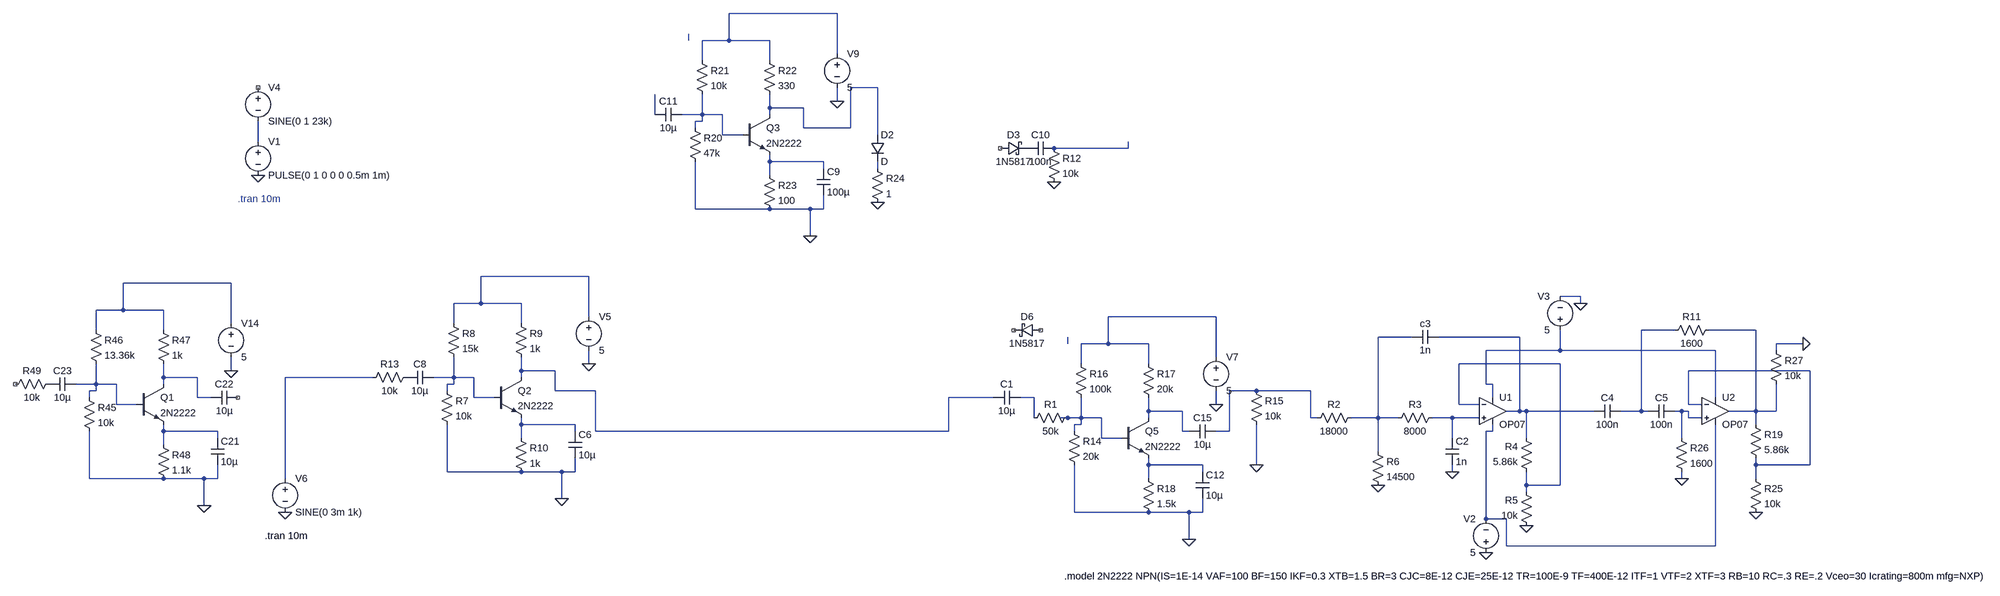
[diagram p0: schematic FinalRx.asc]
FinalRx.asc, the LTspice schematic file:
Version 4
SHEET 1 4116 680
WIRE 768 -880 512 -880
WIRE 416 -816 416 -832
WIRE 512 -816 512 -880
WIRE 512 -816 448 -816
WIRE 608 -816 512 -816
WIRE 768 -784 768 -880
WIRE 448 -768 448 -816
WIRE 608 -768 608 -816
WIRE 864 -704 800 -704
WIRE 768 -672 768 -704
WIRE 608 -656 608 -688
WIRE 688 -656 608 -656
WIRE 336 -640 336 -688
WIRE 448 -640 448 -688
WIRE 448 -640 400 -640
WIRE 496 -640 448 -640
WIRE 608 -640 608 -656
WIRE 448 -624 448 -640
WIRE 448 -624 432 -624
WIRE 432 -608 432 -624
WIRE 688 -608 688 -656
WIRE 800 -608 800 -704
WIRE 800 -608 688 -608
WIRE 496 -592 496 -640
WIRE 544 -592 496 -592
WIRE 864 -592 864 -704
WIRE -720 -576 -720 -624
WIRE 1456 -560 1440 -560
WIRE 1632 -560 1632 -576
WIRE 1632 -560 1456 -560
WIRE 608 -528 608 -544
WIRE 736 -528 608 -528
WIRE 736 -512 736 -528
WIRE 864 -512 864 -528
WIRE 608 -496 608 -528
WIRE 432 -416 432 -528
WIRE 608 -416 432 -416
WIRE 704 -416 608 -416
WIRE 736 -416 736 -448
WIRE 736 -416 704 -416
WIRE 704 -352 704 -416
WIRE 64 -256 -192 -256
WIRE -784 -240 -1040 -240
WIRE 2704 -208 2656 -208
WIRE -192 -192 -192 -256
WIRE -192 -192 -256 -192
WIRE -96 -192 -192 -192
WIRE 2704 -192 2704 -208
WIRE -1040 -176 -1040 -240
WIRE -1040 -176 -1104 -176
WIRE -944 -176 -1040 -176
WIRE 64 -160 64 -256
WIRE 1840 -160 1584 -160
WIRE -784 -144 -784 -240
WIRE -256 -144 -256 -192
WIRE -96 -144 -96 -192
WIRE -1104 -128 -1104 -176
WIRE -944 -128 -944 -176
WIRE 2928 -128 2848 -128
WIRE 3120 -128 3008 -128
WIRE 2304 -112 2224 -112
WIRE 2560 -112 2368 -112
WIRE 1488 -96 1488 -112
WIRE 1584 -96 1584 -160
WIRE 1584 -96 1520 -96
WIRE 1680 -96 1584 -96
WIRE 3232 -96 3168 -96
WIRE 2656 -80 2656 -128
WIRE 2656 -80 2480 -80
WIRE 3024 -80 2656 -80
WIRE 3168 -80 3168 -96
WIRE 1840 -64 1840 -160
WIRE 64 -48 64 -80
WIRE 1520 -48 1520 -96
WIRE 1680 -48 1680 -96
WIRE 2656 -48 2416 -48
WIRE -784 -32 -784 -64
WIRE -96 -32 -96 -64
WIRE -16 -32 -96 -32
WIRE 3248 -32 2960 -32
WIRE -944 -16 -944 -48
WIRE -864 -16 -944 -16
WIRE -448 -16 -656 -16
WIRE -256 -16 -256 -64
WIRE -256 -16 -304 -16
WIRE -208 -16 -256 -16
WIRE -96 -16 -96 -32
WIRE -1104 0 -1104 -48
WIRE -1104 0 -1152 0
WIRE -1056 0 -1104 0
WIRE -944 0 -944 -16
WIRE -256 0 -256 -16
WIRE -256 0 -272 0
WIRE 2480 0 2480 -80
WIRE 2496 0 2480 0
WIRE -1104 16 -1104 0
WIRE -1104 16 -1120 16
WIRE -272 16 -272 0
WIRE -16 16 -16 -32
WIRE 80 16 -16 16
WIRE 1936 16 1872 16
WIRE 2064 16 1936 16
WIRE -1120 32 -1120 16
WIRE -864 32 -864 -16
WIRE -832 32 -864 32
WIRE -208 32 -208 -16
WIRE -160 32 -208 32
WIRE 1312 32 1184 32
WIRE 1408 32 1376 32
WIRE 2496 32 2496 0
WIRE 3024 32 3024 -80
WIRE -1056 48 -1056 0
WIRE -1008 48 -1056 48
WIRE 1840 48 1840 16
WIRE 2416 48 2416 -48
WIRE 2464 48 2416 48
WIRE 2960 48 2960 -32
WIRE 2992 48 2960 48
WIRE 1680 64 1680 32
WIRE 1760 64 1680 64
WIRE 2560 64 2560 -112
WIRE 2560 64 2528 64
WIRE 2576 64 2560 64
WIRE 2736 64 2576 64
WIRE 2848 64 2848 -128
WIRE 2848 64 2800 64
WIRE 2864 64 2848 64
WIRE 2944 64 2928 64
WIRE 2960 64 2944 64
WIRE 3120 64 3120 -128
WIRE 3120 64 3056 64
WIRE 3168 64 3168 0
WIRE 3168 64 3120 64
WIRE 1408 80 1408 32
WIRE 1488 80 1472 80
WIRE 1520 80 1520 32
WIRE 1520 80 1488 80
WIRE 1568 80 1520 80
WIRE 1680 80 1680 64
WIRE 2064 80 2064 16
WIRE 2080 80 2064 80
WIRE 2224 80 2224 -112
WIRE 2224 80 2160 80
WIRE 2272 80 2224 80
WIRE 2400 80 2352 80
WIRE 2464 80 2400 80
WIRE 2960 80 2960 64
WIRE 2992 80 2960 80
WIRE -96 96 -96 80
WIRE 32 96 -96 96
WIRE 1520 96 1520 80
WIRE 1520 96 1504 96
WIRE 3120 96 3120 64
WIRE -944 112 -944 96
WIRE -816 112 -944 112
WIRE 32 112 32 96
WIRE 80 112 80 16
WIRE 1184 112 1184 32
WIRE 1184 112 80 112
WIRE 1504 112 1504 96
WIRE 1760 112 1760 64
WIRE 1776 112 1760 112
WIRE 1872 112 1872 16
WIRE 1872 112 1840 112
WIRE 2496 112 2496 96
WIRE 2496 112 2480 112
WIRE -816 128 -816 112
WIRE -96 128 -96 96
WIRE 1568 128 1568 80
WIRE 1616 128 1568 128
WIRE 2400 128 2400 80
WIRE 2576 128 2576 64
WIRE 2944 128 2944 64
WIRE -944 144 -944 112
WIRE 2224 160 2224 80
WIRE 1680 192 1680 176
WIRE 1808 192 1680 192
WIRE 1936 192 1936 96
WIRE 3120 192 3120 176
WIRE 3248 192 3248 -32
WIRE 3248 192 3120 192
WIRE -272 208 -272 96
WIRE -96 208 -272 208
WIRE 0 208 -96 208
WIRE 32 208 32 176
WIRE 32 208 0 208
WIRE 1808 208 1808 192
WIRE 2400 208 2400 192
WIRE -1120 224 -1120 112
WIRE -944 224 -1120 224
WIRE -848 224 -944 224
WIRE -816 224 -816 192
WIRE -816 224 -848 224
WIRE -656 224 -656 -16
WIRE 1680 224 1680 192
WIRE 2944 224 2944 208
WIRE 3120 224 3120 192
WIRE 2576 240 2576 208
WIRE 2656 240 2656 -48
WIRE 2656 240 2576 240
WIRE 2576 256 2576 240
WIRE 0 272 0 208
WIRE -848 288 -848 224
WIRE 1504 304 1504 192
WIRE 1680 304 1504 304
WIRE 1776 304 1680 304
WIRE 1808 304 1808 272
WIRE 1808 304 1776 304
WIRE 2480 320 2480 112
WIRE 2528 320 2480 320
WIRE 1776 368 1776 304
WIRE 2528 384 2528 320
WIRE 3024 384 3024 96
WIRE 3024 384 2528 384
FLAG -720 -496 0
FLAG 768 -672 0
FLAG 704 -352 0
FLAG 864 -432 0
FLAG 1456 -480 0
FLAG -656 304 0
FLAG -784 -32 0
FLAG -848 288 0
FLAG 64 -48 0
FLAG 0 272 0
FLAG 1840 48 0
FLAG 1776 368 0
FLAG 1936 192 0
FLAG 2224 240 0
FLAG 2400 208 0
FLAG 2576 336 0
FLAG 2704 -192 0
FLAG 2480 400 0
FLAG 3120 304 0
FLAG 2944 224 0
FLAG 3232 -96 0
SYMBOL voltage -720 -592 R0
WINDOW 123 0 0 Left 0
WINDOW 39 0 0 Left 0
SYMATTR InstName V1
SYMATTR Value PULSE(0 1 0 0 0 0.5m 1m)
SYMBOL voltage -720 -720 R0
WINDOW 123 0 0 Left 0
WINDOW 39 0 0 Left 0
SYMATTR InstName V4
SYMATTR Value SINE(0 1 23k)
SYMBOL res 416 -624 R0
SYMATTR InstName R20
SYMATTR Value 47k
SYMBOL res 432 -784 R0
SYMATTR InstName R21
SYMATTR Value 10k
SYMBOL res 592 -784 R0
SYMATTR InstName R22
SYMATTR Value 330
SYMBOL res 592 -512 R0
SYMATTR InstName R23
SYMATTR Value 100
SYMBOL npn 544 -640 R0
SYMATTR InstName Q3
SYMATTR Value 2N2222
SYMBOL voltage 768 -800 R0
WINDOW 123 0 0 Left 0
WINDOW 39 0 0 Left 0
SYMATTR InstName V9
SYMATTR Value 5
SYMBOL cap 720 -512 R0
SYMATTR InstName C9
SYMATTR Value 100µ
SYMBOL cap 400 -656 R90
WINDOW 0 0 32 VBottom 2
WINDOW 3 32 32 VTop 2
SYMATTR InstName C11
SYMATTR Value 10µ
SYMBOL res 848 -528 R0
SYMATTR InstName R24
SYMATTR Value 1
SYMBOL diode 848 -592 R0
SYMATTR InstName D2
SYMBOL schottky 1328 -544 R270
WINDOW 0 32 32 VTop 2
WINDOW 3 0 32 VBottom 2
SYMATTR InstName D3
SYMATTR Value 1N5817
SYMATTR Description Diode
SYMATTR Type diode
SYMBOL cap 1456 -576 R90
WINDOW 0 0 32 VBottom 2
WINDOW 3 32 32 VTop 2
SYMATTR InstName C10
SYMATTR Value 100n
SYMBOL res 1440 -576 R0
SYMATTR InstName R12
SYMATTR Value 10k
SYMBOL voltage -656 208 R0
WINDOW 123 0 0 Left 0
WINDOW 39 0 0 Left 0
SYMATTR InstName V6
SYMATTR Value SINE(0 3m 1k)
SYMBOL res -1136 16 R0
SYMATTR InstName R45
SYMATTR Value 10k
SYMBOL res -1120 -144 R0
SYMATTR InstName R46
SYMATTR Value 13.36k
SYMBOL res -960 -144 R0
SYMATTR InstName R47
SYMATTR Value 1k
SYMBOL res -960 128 R0
SYMATTR InstName R48
SYMATTR Value 1.1k
SYMBOL npn -1008 0 R0
SYMATTR InstName Q1
SYMATTR Value 2N2222
SYMBOL voltage -784 -160 R0
WINDOW 123 0 0 Left 0
WINDOW 39 0 0 Left 0
SYMATTR InstName V14
SYMATTR Value 5
SYMBOL cap -832 128 R0
SYMATTR InstName C21
SYMATTR Value 10µ
SYMBOL cap -768 16 R90
WINDOW 0 0 32 VBottom 2
WINDOW 3 32 32 VTop 2
SYMATTR InstName C22
SYMATTR Value 10µ
SYMBOL cap -1152 -16 R90
WINDOW 0 0 32 VBottom 2
WINDOW 3 32 32 VTop 2
SYMATTR InstName C23
SYMATTR Value 10µ
SYMBOL res -1200 -16 R90
WINDOW 0 0 56 VBottom 2
WINDOW 3 32 56 VTop 2
SYMATTR InstName R49
SYMATTR Value 10k
SYMBOL res -288 0 R0
SYMATTR InstName R7
SYMATTR Value 10k
SYMBOL res -272 -160 R0
SYMATTR InstName R8
SYMATTR Value 15k
SYMBOL res -112 -160 R0
SYMATTR InstName R9
SYMATTR Value 1k
SYMBOL res -112 112 R0
SYMATTR InstName R10
SYMATTR Value 1k
SYMBOL npn -160 -16 R0
SYMATTR InstName Q2
SYMATTR Value 2N2222
SYMBOL voltage 64 -176 R0
WINDOW 123 0 0 Left 0
WINDOW 39 0 0 Left 0
SYMATTR InstName V5
SYMATTR Value 5
SYMBOL cap 16 112 R0
SYMATTR InstName C6
SYMATTR Value 10µ
SYMBOL cap -304 -32 R90
WINDOW 0 0 32 VBottom 2
WINDOW 3 32 32 VTop 2
SYMATTR InstName C8
SYMATTR Value 10µ
SYMBOL res -352 -32 R90
WINDOW 0 0 56 VBottom 2
WINDOW 3 32 56 VTop 2
SYMATTR InstName R13
SYMATTR Value 10k
SYMBOL schottky 1424 -144 R90
WINDOW 0 0 32 VBottom 2
WINDOW 3 32 32 VTop 2
SYMATTR InstName D6
SYMATTR Value 1N5817
SYMATTR Description Diode
SYMATTR Type diode
SYMBOL res 1488 96 R0
SYMATTR InstName R14
SYMATTR Value 20k
SYMBOL res 1504 -64 R0
SYMATTR InstName R16
SYMATTR Value 100k
SYMBOL res 1664 -64 R0
SYMATTR InstName R17
SYMATTR Value 20k
SYMBOL res 1664 208 R0
SYMATTR InstName R18
SYMATTR Value 1.5k
SYMBOL npn 1616 80 R0
SYMATTR InstName Q5
SYMATTR Value 2N2222
SYMBOL voltage 1840 -80 R0
WINDOW 123 0 0 Left 0
WINDOW 39 0 0 Left 0
SYMATTR InstName V7
SYMATTR Value 5
SYMBOL cap 1792 208 R0
SYMATTR InstName C12
SYMATTR Value 10µ
SYMBOL res 1920 0 R0
SYMATTR InstName R15
SYMATTR Value 10k
SYMBOL cap 1840 96 R90
WINDOW 0 0 32 VBottom 2
WINDOW 3 32 32 VTop 2
SYMATTR InstName C15
SYMATTR Value 10µ
SYMBOL cap 1376 16 R90
WINDOW 0 0 32 VBottom 2
WINDOW 3 32 32 VTop 2
SYMATTR InstName C1
SYMATTR Value 10µ
SYMBOL res 1504 64 R90
WINDOW 0 0 56 VBottom 2
WINDOW 3 32 56 VTop 2
SYMATTR InstName R1
SYMATTR Value 50k
SYMBOL res 2176 64 R90
WINDOW 0 0 56 VBottom 2
WINDOW 3 32 56 VTop 2
SYMATTR InstName R2
SYMATTR Value 18000
SYMBOL res 2368 64 R90
WINDOW 0 0 56 VBottom 2
WINDOW 3 32 56 VTop 2
SYMATTR InstName R3
SYMATTR Value 8000
SYMBOL res 2592 224 R180
WINDOW 0 36 76 Left 2
WINDOW 3 36 40 Left 2
SYMATTR InstName R4
SYMATTR Value 5.86k
SYMBOL res 2592 352 R180
WINDOW 0 36 76 Left 2
WINDOW 3 36 40 Left 2
SYMATTR InstName R5
SYMATTR Value 10k
SYMBOL res 2208 144 R0
SYMATTR InstName R6
SYMATTR Value 14500
SYMBOL cap 2384 128 R0
SYMATTR InstName C2
SYMATTR Value 1n
SYMBOL OpAmps\\OP07 2496 0 R0
SYMATTR InstName U1
SYMBOL cap 2368 -128 R90
WINDOW 0 0 32 VBottom 2
WINDOW 3 32 32 VTop 2
SYMATTR InstName c3
SYMATTR Value 1n
SYMBOL voltage 2480 416 R180
WINDOW 0 24 96 Left 2
WINDOW 3 24 16 Left 2
WINDOW 123 0 0 Left 0
WINDOW 39 0 0 Left 0
SYMATTR InstName V2
SYMATTR Value 5
SYMBOL voltage 2656 -112 R180
WINDOW 0 24 96 Left 2
WINDOW 3 24 16 Left 2
WINDOW 123 0 0 Left 0
WINDOW 39 0 0 Left 0
SYMATTR InstName V3
SYMATTR Value 5
SYMBOL OpAmps\\OP07 3024 0 R0
SYMATTR InstName U2
SYMBOL cap 2800 48 R90
WINDOW 0 0 32 VBottom 2
WINDOW 3 32 32 VTop 2
SYMATTR InstName C4
SYMATTR Value 100n
SYMBOL cap 2928 48 R90
WINDOW 0 0 32 VBottom 2
WINDOW 3 32 32 VTop 2
SYMATTR InstName C5
SYMATTR Value 100n
SYMBOL res 3024 -144 R90
WINDOW 0 0 56 VBottom 2
WINDOW 3 32 56 VTop 2
SYMATTR InstName R11
SYMATTR Value 1600
SYMBOL res 3104 80 R0
SYMATTR InstName R19
SYMATTR Value 5.86k
SYMBOL res 3104 208 R0
SYMATTR InstName R25
SYMATTR Value 10k
SYMBOL res 2928 112 R0
SYMATTR InstName R26
SYMATTR Value 1600
SYMBOL res 3152 -96 R0
SYMATTR InstName R27
SYMATTR Value 10k
TEXT -768 -440 Left 2 ;.tran 10m
TEXT -704 360 Left 2 !.tran 10m
TEXT 1480 456 Left 2 !.model 2N2222 NPN(IS=1E-14 VAF=100 BF=150 IKF=0.3 XTB=1.5 BR=3 CJC=8E-12 CJE=25E-12 TR=100E-9 TF=400E-12 ITF=1 VTF=2 XTF=3 RB=10 RC=.3 RE=.2 Vceo=30 Icrating=800m mfg=NXP)

The netlist it stands for:
* FinalRx.asc
V1 N006 0 PULSE(0 1 0 0 0 0.5m 1m)
V4 NC_01 N006 SINE(0 1 23k)
R20 N005 0 47k
R21 N001 N005 10k
R22 N001 N003 330
R23 N008 0 100
Q3 N003 N005 N008 0 2N2222
V9 N001 0 5
C9 N008 0 100µ
C11 N005 N004 10µ
R24 N009 0 1
D2 N003 N009 D
D3 NC_02 P001 1N5817
C10 N007 P001 100n
R12 N007 0 10k
V6 N023 0 SINE(0 3m 1k)
R45 N025 0 10k
R46 N011 N025 13.36k
R47 N011 N022 1k
R48 N033 0 1.1k
Q1 N022 N025 N033 0 2N2222
V14 N011 0 5
C21 N033 0 10µ
C22 NC_03 N022 10µ
C23 N025 P002 10µ
R49 P002 NC_04 10k
R7 N024 0 10k
R8 N010 N024 15k
R9 N010 N020 1k
R10 N032 0 1k
Q2 N020 N024 N032 0 2N2222
V5 N010 0 5
C6 N032 0 10µ
C8 N024 P003 10µ
R13 P003 N023 10k
D6 NC_05 NC_06 1N5817
R14 N030 0 20k
R16 N012 N030 100k
R17 N012 N028 20k
R18 N035 0 1.5k
Q5 N028 N030 N035 0 2N2222
V7 N012 0 5
C12 N035 0 10µ
R15 N026 0 10k
C15 N026 N028 10µ
C1 N027 N020 10µ
R1 N030 N027 50k
R2 N015 N026 18000
R3 N031 N015 8000
R4 N019 N016 5.86k
R5 0 N019 10k
R6 N015 0 14500
C2 N031 0 1n
XU1 N031 N019 N018 N034 N016 LT1001  ; OP07, pins In+ In- V+ V- OUT
c3 N016 N015 1n
V2 0 N034 5
V3 N018 0 5
XU2 N029 N021 N018 N034 N014 LT1001  ; OP07, pins In+ In- V+ V- OUT
C4 N013 N016 100n
C5 N029 N013 100n
R11 N014 N013 1600
R19 N014 N021 5.86k
R25 N021 0 10k
R26 N029 0 1600
R27 0 N014 10k
.model D D
.lib standard.dio
.model NPN NPN
.model PNP PNP
.lib standard.bjt
* .tran 10m
.tran 10m
.model 2N2222 NPN(IS=1E-14 VAF=100 BF=150 IKF=0.3 XTB=1.5 BR=3 CJC=8E-12 CJE=25E-12 TR=100E-9 TF=400E-12 ITF=1 VTF=2 XTF=3 RB=10 RC=.3 RE=.2 Vceo=30 Icrating=800m mfg=NXP)
.lib LTC.lib
.backanno
.end